# Altium schematic sheet PowerManagement.SchDoc: Teknofest Project
size A4; SheetNumber: 3; SheetTotal: 4; Prepared by: Mustafa Oğuz Ateş
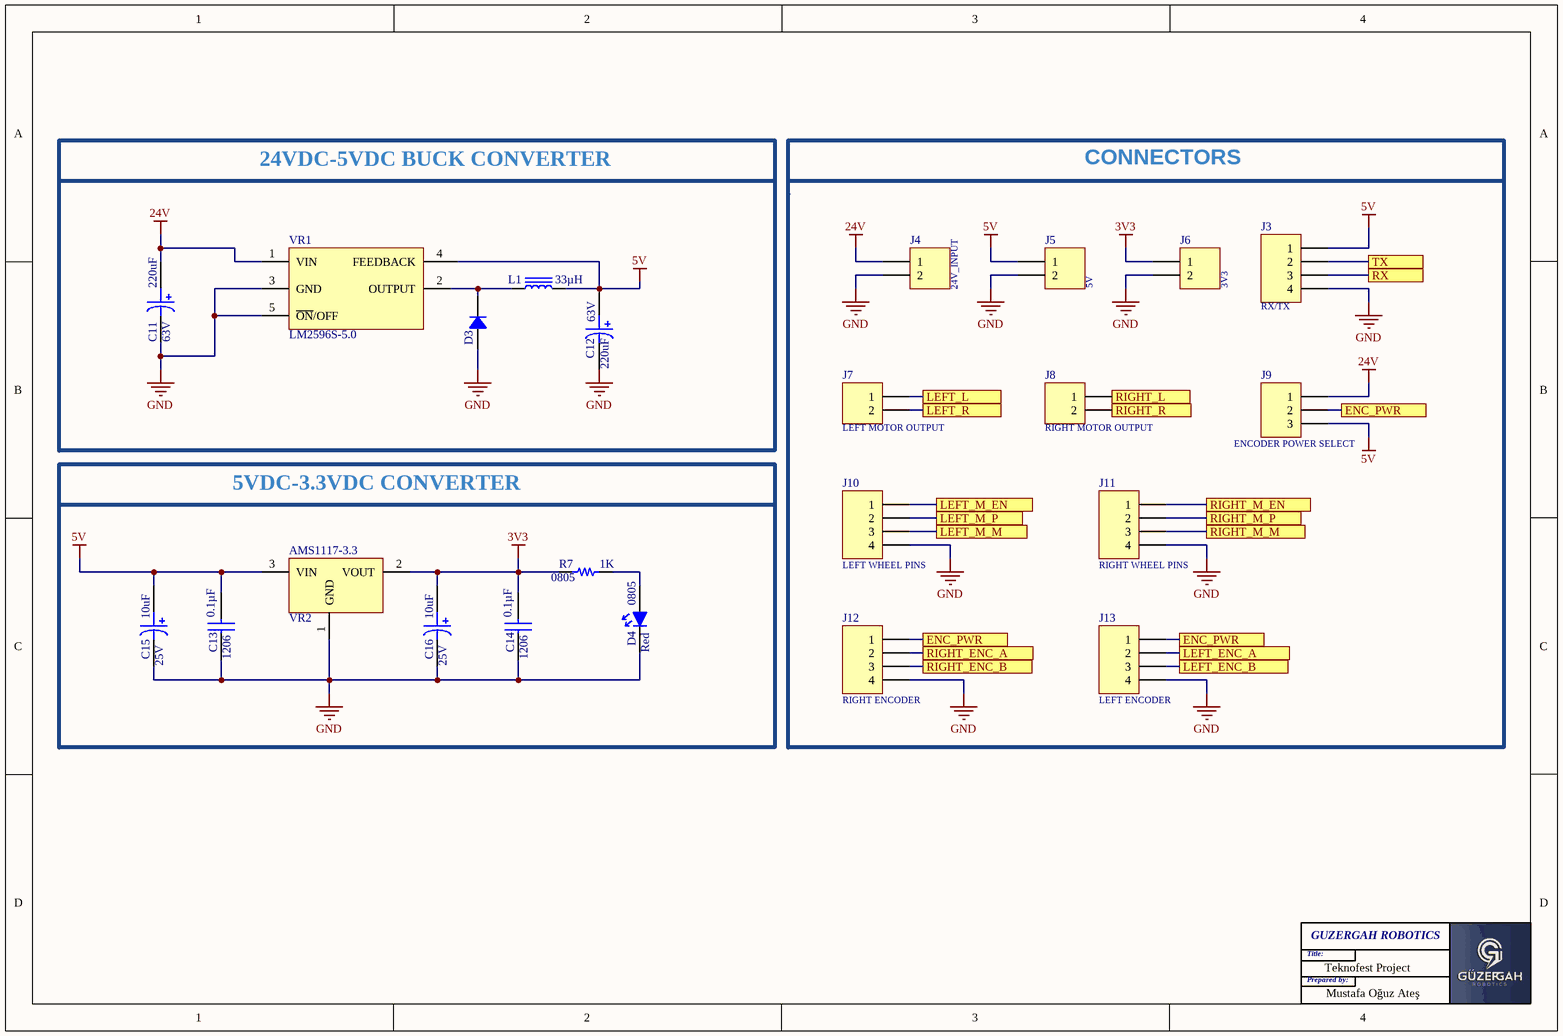
[diagram p0: PowerManagement.SchDoc]

## Parts
C11  value 220uF  Voltage - Rated: 63V  [CAP_ALUM_220uF_10x16 5MM]  (hidden comment: RD1J227M10016PA100)
C12  value 220uF  Voltage - Rated: 63V  [CAP_ALUM_220uF_10x16 5MM]  (hidden comment: RD1J227M10016PA100)
C13  value 0.1µF  Package / Case: 1206  [CAP_1206_0.1uF]  (hidden comment: CAP_1206_0.1uF)
C14  value 0.1µF  Package / Case: 1206  [CAP_1206_0.1uF]  (hidden comment: CAP_1206_0.1uF)
C15  value 10uF  Voltage - Rated: 25V  [CAP_ALUM_10uF_TH]  (hidden comment: PKRJ-025V100MB070)
C16  value 10uF  Voltage - Rated: 25V  [CAP_ALUM_10uF_TH]  (hidden comment: PKRJ-025V100MB070)
D3  SK56-HT  [DIODE SCHOTTKY]  (value not drawn)
D4  Package / Case: 0805  Color: Red  [LED_RED_0805]  (hidden comment: LED RED 0805)
J3  DS1023-1X4S21  [RX/TX HEADER]  (value not drawn)
J4  DG381S-3.81-02P-14-00AH  [24V_IN KONNEKTÖR]  (value not drawn)
J5  L-KLS1-208-1-02-S  [5V JUMPER]  (value not drawn)
J6  L-KLS1-208-1-02-S  [3V3 JUMPER]  (value not drawn)
J7  DG381S-3.81-02P-14-00AH  [LEFT MOTOR OUTPUT CONNECTOR]  (value not drawn)
J8  DG381S-3.81-02P-14-00AH  [RIGHT MOTOR OUTPUT CONNECTOR]  (value not drawn)
J9  DS1023-1X3S21  [ENCODER POWER SELECT.1]  (value not drawn)
J10  DS1023-1X4S21  [LEFT WHEEL PINS]  (value not drawn)
J11  DS1023-1X4S21  [RIGHT WHEEL PINS]  (value not drawn)
J12  15EDGA-3.81-04P-14-00AH  [RIGHT ENCODER]  (value not drawn)
J13  15EDGA-3.81-04P-14-00AH  [LEFT ENCODER]  (value not drawn)
L1  value 33µH  [INDUCTOR POWER]  (hidden comment: SRR1280-330M)
R7  value 1K  Package / Case: 0805  [RES_0805_1K]  (hidden comment: RES_0805_1K)
VR1  LM2596S-5.0  [TO263-5 (D2PAK)]
VR2  AMS1117-3.3  [SOT-223]

## Blocks framed on the sheet
24VDC-5VDC BUCK CONVERTER: C11 C12 D3 L1 VR1
CONNECTORS: J3-J13
5VDC-3.3VDC CONVERTER: C13-C16 D4 R7 VR2

## Ports
ENC_PWR, LEFT_ENC_A, LEFT_ENC_B, LEFT_L, LEFT_M_EN, LEFT_M_M, LEFT_M_P, LEFT_R, RIGHT_ENC_A, RIGHT_ENC_B, RIGHT_L, RIGHT_M_EN, RIGHT_M_M, RIGHT_M_P, RIGHT_R, RX, TX

## Nets
3V3: C14.2 C16.1 J6.1 R7.1 VR2.2(VOUT)
5V: C12.1 C13.2 C15.1 J3.1 J5.1 J9.3 L1.2 VR2.3(VIN)
24V: C11.1 J4.1 J9.1 VR1.1(VIN)
GND: C11.2 C12.2 C13.1 C14.1 C15.2 C16.2 D3.2 D4.1 J3.4 J4.2 J5.2 J6.2 J10.4 J11.4 J12.4 J13.4 VR1.3(GND) VR1.5(~{ON}/OFF) VR2.1(GND)
ENC_PWR: J9.2 J12.1 J13.1 ; port ENC_PWR
LEFT_ENC_A: J13.2 ; port LEFT_ENC_A
LEFT_ENC_B: J13.3 ; port LEFT_ENC_B
LEFT_L: J7.1 ; port LEFT_L
LEFT_M_EN: J10.1 ; port LEFT_M_EN
LEFT_M_M: J10.3 ; port LEFT_M_M
LEFT_M_P: J10.2 ; port LEFT_M_P
LEFT_R: J7.2 ; port LEFT_R
RIGHT_ENC_A: J12.2 ; port RIGHT_ENC_A
RIGHT_ENC_B: J12.3 ; port RIGHT_ENC_B
RIGHT_L: J8.1 ; port RIGHT_L
RIGHT_M_EN: J11.1 ; port RIGHT_M_EN
RIGHT_M_M: J11.3 ; port RIGHT_M_M
RIGHT_M_P: J11.2 ; port RIGHT_M_P
RIGHT_R: J8.2 ; port RIGHT_R
RX: J3.3 ; port RX
TX: J3.2 ; port TX
NetD3_1: D3.1 L1.1 VR1.2(OUTPUT)
NetD4_2: D4.2 R7.2

Not connected (* = marked no-connect by the designer): VR1 4(FEEDBACK)

## Notes on the sheet
- (near J4) 24V_INPUT
- (near J5) 5V
- (near J6) 3V3
- (near J3) RX/TX
- (near J7) LEFT MOTOR OUTPUT
- (near J8) RIGHT MOTOR OUTPUT
- (near J9) ENCODER POWER SELECT
- (near J10) LEFT WHEEL PINS
- (near J11) RIGHT WHEEL PINS
- (near J12) RIGHT ENCODER
- (near J13) LEFT ENCODER
- Title:
- Prepared by:
- GUZERGAH ROBOTICS
- (in symbol AMS1117-3.3) /

## Library data of the parts
C11 C12 = CAP_ALUM_220uF_TH: CAP.EL.220uF 63V 10x16 5MM 105C
C13 C14 = CAP_1206_0.1uF: CAP CER 0.1 uF 1206
C15 C16 = CAP_ALUM_10uF_TH: CAP.EL.10uF 25V 4x7 1.5MM 105C BULK KOSHIN; ComponentLink1Description: New link; ComponentLink1URL: https://www.ozdisan.com/pasif-komponentler/kapasitorler/aluminyum-kapasitorler/PKRJ-025V100MB070/345328
D3 = DIODE SCHOTTKY: 5A 60V DO214AB SMC
D4 = LED RED 0805: KOMPONENT SEÇİLMEDİ; Manufacturer: Osram Opto; Manufacturer Part Number: LH R974-LP-1; Lens Color: White; Forward Voltage: 1.8V; Lens Style: Diffused,Flat,Colorless; Luminous Intensity: 71mcd; Viewing Angle: 160°; Forward Current: 30mA; Dominant Wavelength: 645nm; Number of Elements: 1; Test Current: 20mA; Reverse Voltage: 5V; Lens Transparency: Diffused; Luminous Flux: 0.17lm; Lens Size: 1.25mm; Designed by: Mustafa; Supplier 1: Digi-Key; RoHS: Yes; Category: LEDs; Stock 1: 35632; Pricing 1: 1=0,26000, 10=0,13900, 100=0,06480, 500=0,05978, 1000=0,04683, 2000=0,04584 (USD); Mount: Surface Mount; Number of Pins: 2; Case Code (Imperial): 0805; Case Code (Metric): 2012; Min Operating Temperature: -30°C; Max Operating Temperature: 85°C; Packaging: Tape and Reel; Illumination Color: Red; Package Quantity: 1; Series: CHipLED; Length: 2.1mm; Width: 1.25mm; Depth: 1.35mm; Radiation Hardening: No; RoHS Compliant: Yes; ComponentLink1URL: http://www.jameco.com/Jameco/Products/ProdDS/2085634.pdf?src-supplier=Jameco; ComponentLink1Description: http://www.jameco.com/Jameco/Products/ProdDS/2085634.pdf?src-supplier=Jameco; ComponentLink2URL: http://components.arrow.com/part/dataview/0323_01825492?src-supplier=Arrow+Europe; ComponentLink2Description: http://components.arrow.com/part/dataview/0323_01825492?src-supplier=Arrow+Europe; ComponentLink3URL: https://dammedia.osram.info/media/resource/hires/osram-dam-2493888/LH%20R974.pdf?src-supplier=Digi-Key; ComponentLink3Description: https://dammedia.osram.info/media/resource/hires/osram-dam-2493888/LH%20R974.pdf?src-supplier=Digi-Key; ComponentLink4URL: http://www.mouser.com/ds/2/311/LH%20R974%20-%20CHIPLED%200805-318659.pdf?src-supplier=Mouser; ComponentLink4Description: http://www.mouser.com/ds/2/311/LH%20R974%20-%20CHIPLED%200805-318659.pdf?src-supplier=Mouser; ComponentLink5URL: https://www.verical.com/server-webapp/html/getDatasheet?partID=258950&src-supplier=Verical; ComponentLink5Description: https://www.verical.com/server-webapp/html/getDatasheet?partID=258950&src-supplier=Verical; ComponentLink6URL: http://components.arrow.com/part/dataview/41971690S1077610N9133?src-supplier=Arrow+Electronics; ComponentLink6Description: http://components.arrow.com/part/dataview/41971690S1077610N9133?src-supplier=Arrow+Electronics; ComponentLink7URL: http://components.arrow.com/part/dataview/41971690S6190115N2128?src-supplier=Arrow+Electronics; ComponentLink7Description: http://components.arrow.com/part/dataview/41971690S6190115N2128?src-supplier=Arrow+Electronics; Supplier Part Number 1: 475-1415-1-ND
J3 = RX/TX HEADER: FEMALE HEADER 4PIN(1x4) 2.54mm THT V/T TRAY; ComponentLink1Description: New link; ComponentLink1URL: https://ozdisan.com/konnektor-ve-baglanti-elemanlari/header-konnektorler/disi-headerlar/DS1023-1X4S21/353863
J4 = 24V_IN: TERM.BLK.3.81MM 2P PCB TYPE GREEN; ComponentLink1Description: New link; ComponentLink1URL: https://ozdisan.com/Product/Detail/440917/DG381S-3-81-02P-14-00AH
J5 = 5V_JUMPER_HEADER: FEMALE HEADER 2PIN(1x2) 2.54mm THT V/T TRAY; ComponentLink1Description: New link; ComponentLink1URL: https://ozdisan.com/konnektor-ve-baglanti-elemanlari/header-konnektorler/disi-headerlar/L-KLS1-208-1-02-S/596182
J6 = 3V3_JUMPER_HEADER: FEMALE HEADER 2PIN(1x2) 2.54mm THT V/T TRAY; ComponentLink1Description: New link; ComponentLink1URL: https://ozdisan.com/konnektor-ve-baglanti-elemanlari/header-konnektorler/disi-headerlar/L-KLS1-208-1-02-S/596182
J7 = LEFT MOTOR OUTPUT: DG381S-3.81-02P-14-00AH - TERM.BLK.3.81MM 2P PCB TYPE GREEN
J8 = RIGHT MOTOR OUTPUT: DG381S-3.81-02P-14-00AH - TERM.BLK.3.81MM 2P PCB TYPE GREEN
J9 = ENCODER POWER SELECT: FEMALE HEADER 3PIN(1x3) 2.54mm THT V/T; ComponentLink1Description: New link; ComponentLink1URL: https://ozdisan.com/konnektor-ve-baglanti-elemanlari/header-konnektorler/disi-headerlar/DS1023-1X3S21/702380
J10 = LEFT WHEEL PINS: FEMALE HEADER 4PIN(1x4) 2.54mm THT V/T TRAY; ComponentLink1Description: New link; ComponentLink1URL: https://ozdisan.com/konnektor-ve-baglanti-elemanlari/header-konnektorler/disi-headerlar/DS1023-1X4S21/353863
J11 = RIGHT WHEEL PINS: DS1023-1X4S21 - FEMALE HEADER 4PIN(1x4) 2.54mm THT V/T TRAY; ComponentLink1Description: New link; ComponentLink1URL: https://ozdisan.com/konnektor-ve-baglanti-elemanlari/header-konnektorler/disi-headerlar/DS1023-1X4S21/353863
J12 = RIGHT ENCODER: TERM.BLK.3.81MM 4P FEMALE GREEN; ComponentLink1Description: New link; ComponentLink1URL: https://ozdisan.com/Product/Detail/638461/15EDGA-3-81-04P-14-00AH
J13 = LEFT ENCODER: TERM.BLK.3.81MM 4P FEMALE GREEN KLEMENS; ComponentLink1Description: New link; ComponentLink1URL: https://ozdisan.com/konnektor-ve-baglanti-elemanlari/klemensler/pcb-klemensler/15EDGA-3-81-04P-14-00AH/638461
L1 = INDUCTOR_POWER_33uH: INDUCTOR POWER 33UH 3.5A SMD BOURNS
R7 = RES_0805_1K: RES 0805 1K ohm
VR1 = LM2596S-5.0: LM2596S-5.0 - IC-2596 REG BUCK 5V 3A TO263-5; ComponentLink1Description: New link; ComponentLink1URL: https://ozdisan.com/entegre-devreler-icler/guc-entegreleri/dc-dc-voltaj-regulatorleri/LM2596S-5-0
VR2 = AMS1117-3.3: IC-1117 V.REG. 1A 3V3 SOT223 SMD AMS; Manufacturer: UMW(Youtai Semiconductor Co., Ltd.); Designed by: Mustafa oğuz Ateş; Supplier: Digikey; Supplier Part Number: 4518-AMS1117-3.3CT-ND; Manufacturer Part Number: AMS1117-3.3; RoHS: No; Category: Uncategorized; Pricing: 1=0,48, 10=0,388, 25=0,3552, 100=0,2644, 250=0,2396, 500=0,19828, 1000=0,14871 (USD)